# EAGLE schematic main (EAGLE 7.2.0)
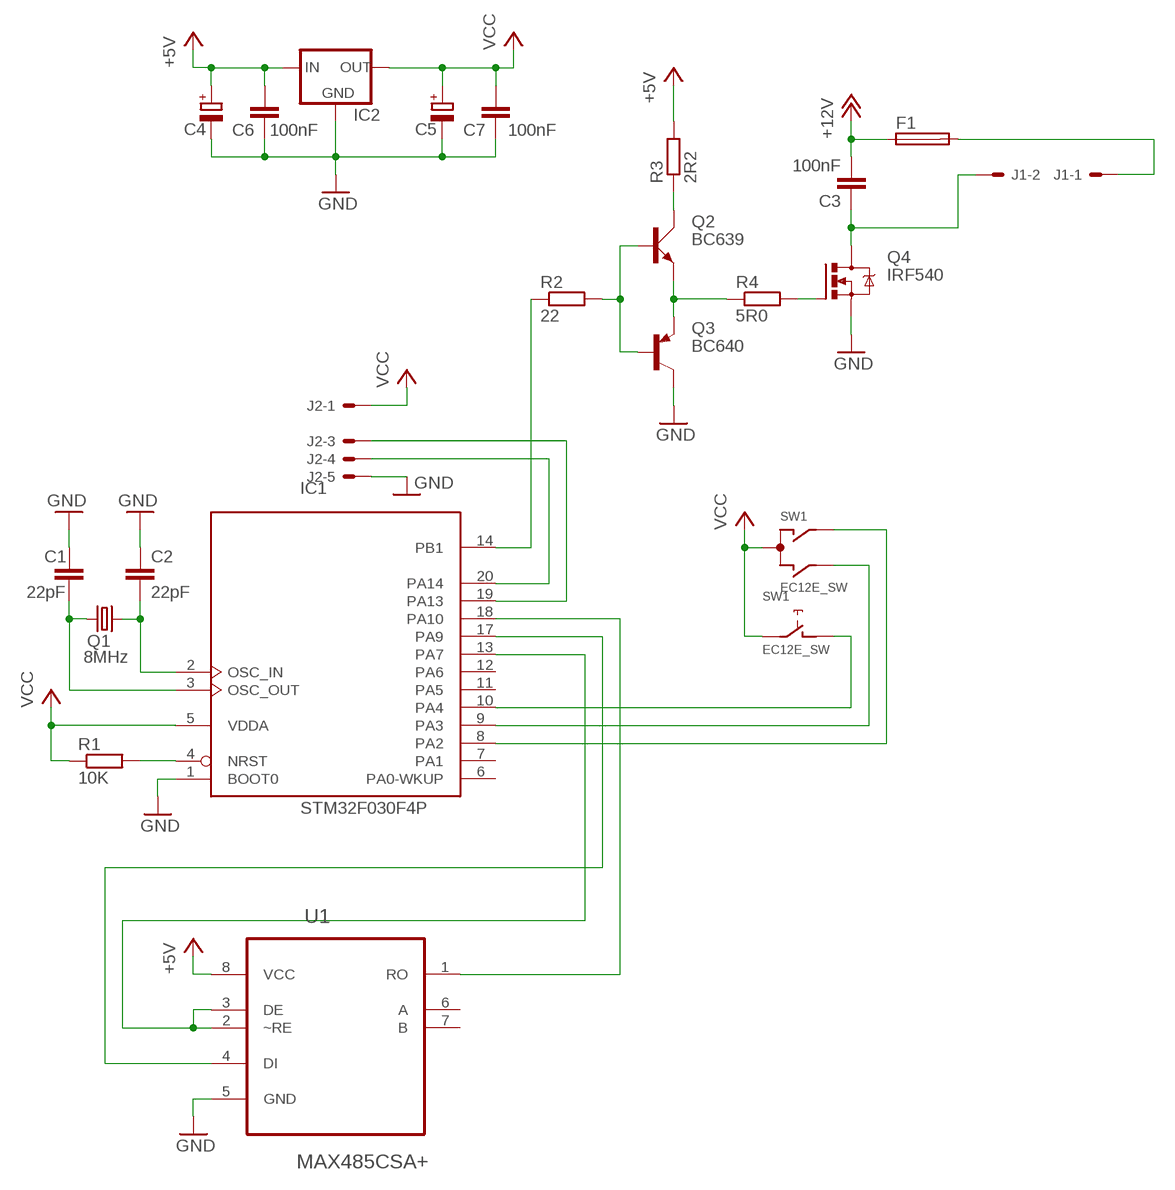
[diagram p0: schematic, sheet 1]

## Parts
C1  22pF  C2,5-3  [C2.5-3]
C2  22pF  C2,5-3  [C2.5-3]
C3  100nF  C2,5-3  [C2.5-3]
C4  CPOL-EU085CS-1AR  [085CS_1AR]
C5  CPOL-EU085CS-1AR  [085CS_1AR]
C6  100nF  C2,5-3  [C2.5-3]
C7  100nF  C2,5-3  [C2.5-3]
F1  TR5  [TR5]
IC1  STM32F030F4P  [TSSOP20-I]
IC2  78LXX  [78LXX]
J1  22-05-7028-02  [7395-02]
J2  22-27-2051-05  [6410-05]
Q1  8MHz  CRYSTALHC18U-V  [HC18U-V]
Q2  BC639  [SOT54D]
Q3  BC640  [TO92-BCE]
Q4  IRF540  [TO220BV]
R1  10K  R-EU_R1206  [R1206]
R2  22  R-EU_R1206  [R1206]
R3  2R2  R-EU_R1206  [R1206]
R4  5R0  R-EU_R1206  [R1206]
SW1  EC12E_SW  [ALPS_EC12E_SW]
U1  MAX485CSA+  [SOIC127P600X175-8N]

## Nets
+5V: C4.+ C6.2 IC2.IN R3.2 U1.8(VCC)
+12V: C3.2 F1.1
GND: C1.1 C2.1 C4.- C5.- C6.1 C7.1 IC1.1(BOOT0) IC2.GND J2.5 Q3.C Q4.S U1.5(GND)
N$1: IC1.17(PA9) U1.4(DI)
N$2: IC1.18(PA10) U1.1(RO)
N$3: IC1.13(PA7) U1.2(~RE) U1.3(DE)
N$4: IC1.14(PB1) R2.1
N$5: IC1.8(PA2) SW1.A
N$6: C1.2 IC1.3(OSC_OUT) Q1.1
N$8: C2.2 IC1.2(OSC_IN) Q1.2
N$9: IC1.9(PA3) SW1.B
N$10: IC1.10(PA4) SW1.D
N$11: Q2.B Q3.B R2.2
N$12: Q2.E Q3.E R4.1
N$13: Q2.C R3.1
N$14: Q4.G R4.2
N$15: C3.1 J1.2 Q4.D
N$16: F1.2 J1.1
N$17: IC1.20(PA14) J2.4
N$18: IC1.19(PA13) J2.3
N$22: IC1.4(NRST) R1.2
VCC: C5.+ C7.2 IC1.5(VDDA) IC2.OUT J2.1 R1.1 SW1.C SW1.E
Unconnected: IC1.6(PA0-WKUP) IC1.7(PA1) IC1.11(PA5) IC1.12(PA6) J2.2 SW1.GND1(G) SW1.GND2(G) U1.6(A) U1.7(B)

## Power pins joined to a net without a drawn wire
VDD: IC1.16(VDD)
VSS: IC1.15(VSS)

## Library data of the parts
C1-C3 C6 C7 = capacitor-wima:C: CAPACITOR naming: grid - package width
C4 C5 = rcl:CPOL-EU: POLARIZED CAPACITOR, European symbol
F1 = fuse:TR5: FUSE Wickmann; OC_FARNELL: unknown; OC_NEWARK: unknown
IC1 = micro-stm_v3:STM32F030F*P: ARM 32-bit Cortex™-M0 CPU 48 MHz maximum frequency 16 Kbytes of Flash memory 4 kbytes of SRAM 15 GPIOs 2.4 to 3.6 V application supply
IC2 = v-reg:78LXX: VOLTAGE REGULATOR
J1 = con-molex:22-?-02: CONNECTOR wire to board 2.54 mm (.1 inch) pitch header; OC_FARNELL: 9731601; OC_NEWARK: unknown
J2 = con-molex:22-?-05: CONNECTOR wire to board 2.54 mm (.1 inch) pitch header; OC_FARNELL: unknown; OC_NEWARK: unknown
Q1 = crystal:CRYSTAL: CRYSTAL; OC_FARNELL: unknown; OC_NEWARK: unknown
Q2 = transistor-small-signal:BC639: NPN TRANSISTOR
Q3 = transistor-pnp:BC640*: PNP Transistror
Q4 = transistor-power:IRF540: HEXFET Power MOSFET
R1-R4 = resistor:R-EU_: RESISTOR, European symbol
SW1 = switch-alps:EC12E_SW: ALPS rotary Encoder EC12E series with switch; MPN: EC12E2424407; OC_FARNELL: 1520813; OC_NEWARK: 74M1068
U1 = Maxim_By_element14_Batch_1:MAX485CSA+: ±15kV ESD-Protected, Slew-Rate-Limited, Low-Power, RS-485/RS-422 Transceivers; MPN: MAX485CSA+; OC_FARNELL: 9725954; OC_NEWARK: 68K4795; PACKAGE: SOIC-8; SUPPLIER: Maxim